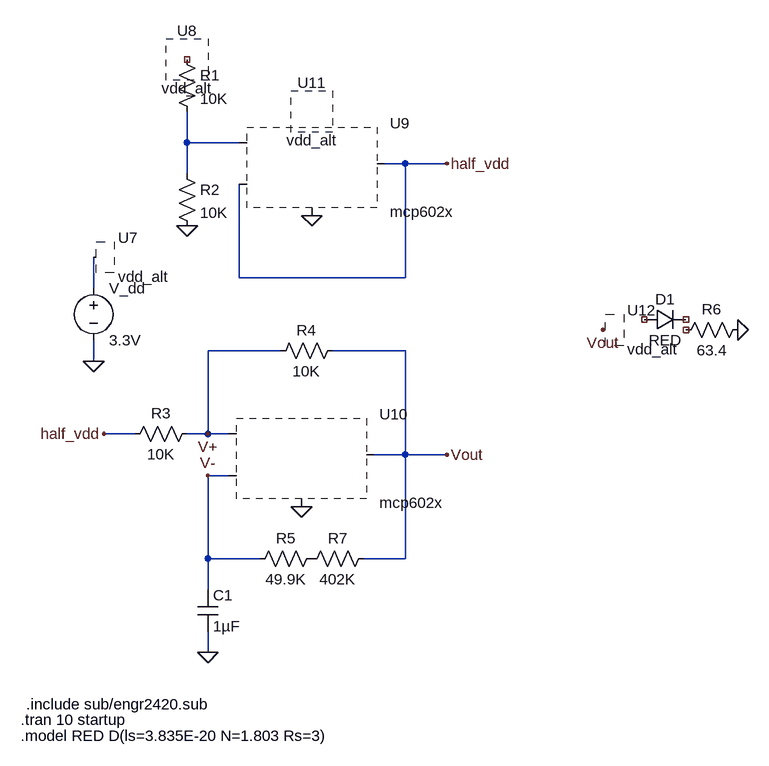
[diagram p0: schematic mp1_sim.asc]
mp1_sim.asc, the LTspice schematic file:
Version 4.1
SHEET 1 1284 680
WIRE 416 -608 416 -656
WIRE 496 -608 416 -608
WIRE 752 -576 720 -576
WIRE 816 -576 752 -576
WIRE 416 -560 416 -608
WIRE 496 -400 496 -544
WIRE 752 -400 752 -576
WIRE 752 -400 496 -400
WIRE 272 -384 272 -432
WIRE 560 -288 448 -288
WIRE 752 -288 640 -288
WIRE 272 -272 272 -304
WIRE 336 -160 288 -160
WIRE 448 -160 448 -288
WIRE 448 -160 416 -160
WIRE 480 -160 448 -160
WIRE 752 -128 752 -288
WIRE 752 -128 704 -128
WIRE 816 -128 752 -128
WIRE 480 -96 448 -96
WIRE 448 32 448 -96
WIRE 528 32 448 32
WIRE 752 32 752 -128
WIRE 752 32 688 32
WIRE 448 80 448 32
WIRE 448 176 448 144
FLAG 272 -272 0
FLAG 608 -496 0
FLAG 592 -48 0
FLAG 416 -480 0
FLAG 816 -576 half_vdd
FLAG 288 -160 half_vdd
FLAG 448 176 0
FLAG 816 -128 Vout
FLAG 1264 -320 0
FLAG 1056 -320 Vout
FLAG 448 -160 V+
FLAG 448 -96 V-
SYMBOL voltage 272 -400 R0
SYMATTR InstName V_dd
SYMATTR Value 3.3V
SYMBOL res 400 -752 R0
SYMATTR InstName R1
SYMATTR Value 10K
SYMATTR SpiceLine tol=1 pwr=1/10
SYMBOL res 400 -576 R0
SYMATTR InstName R2
SYMATTR Value 10K
SYMATTR SpiceLine tol=1 pwr=1/10
SYMBOL res 432 -176 R90
WINDOW 0 0 56 VBottom 2
WINDOW 3 32 56 VTop 2
SYMATTR InstName R3
SYMATTR Value 10K
SYMATTR SpiceLine tol=1 pwr=1/10
SYMBOL res 656 -304 R90
WINDOW 0 0 56 VBottom 2
WINDOW 3 32 56 VTop 2
SYMATTR InstName R4
SYMATTR Value 10K
SYMATTR SpiceLine tol=1 pwr=1/10
SYMBOL cap 432 80 R0
SYMATTR InstName C1
SYMATTR Value 1µF
SYMATTR SpiceLine V=25
SYMBOL diode 1120 -320 R270
WINDOW 0 32 32 VTop 2
WINDOW 3 0 32 VBottom 2
SYMATTR InstName D1
SYMATTR Value RED
SYMBOL res 1280 -336 R90
WINDOW 0 0 56 VBottom 2
WINDOW 3 32 56 VTop 2
SYMATTR InstName R6
SYMATTR Value 63.4
SYMATTR SpiceLine tol=1 pwr=1/10
SYMBOL vdd_alt 272 -432 R0
SYMATTR InstName U7
SYMBOL vdd_alt 416 -736 R0
SYMATTR InstName U8
SYMBOL mcp602x 592 -576 R0
SYMATTR InstName U9
SYMBOL mcp602x 576 -128 R0
SYMATTR InstName U10
SYMBOL vdd_alt 608 -656 R0
SYMATTR InstName U11
SYMBOL vdd_alt 592 -208 R0
SYMATTR InstName U12
SYMBOL res 624 16 R90
WINDOW 0 0 56 VBottom 2
WINDOW 3 32 56 VTop 2
SYMATTR InstName R5
SYMATTR Value 49.9K
SYMATTR SpiceLine tol=1 pwr=1/10
SYMBOL res 704 16 R90
WINDOW 0 0 56 VBottom 2
WINDOW 3 32 56 VTop 2
SYMATTR InstName R7
SYMATTR Value 402K
SYMATTR SpiceLine tol=1 pwr=1/10
TEXT 168 256 Left 2 !.include sub/engr2420.sub
TEXT 160 280 Left 2 !.tran 10 startup
TEXT 160 304 Left 2 !.model RED D(ls=3.835E-20 N=1.803 Rs=3)

The netlist it stands for:
* mp1_sim.asc
V_dd N002 0 3.3V
R1 NC_01 N001 10K tol=1 pwr=1/10
R2 N001 0 10K tol=1 pwr=1/10
R3 V+ half_vdd 10K tol=1 pwr=1/10
R4 Vout V+ 10K tol=1 pwr=1/10
C1 V- 0 1µF V=25
D1 NC_02 NC_03 RED
R6 0 NC_04 63.4 tol=1 pwr=1/10
* U7: vdd_alt (symbol vdd_alt not available, pin order unknown); nets seen at it: N002
* U8: vdd_alt (symbol vdd_alt not available, pin order unknown); nets seen at it: 
* U9: mcp602x (symbol mcp602x not available, pin order unknown); nets seen at it: 0, half_vdd, N001
* U10: mcp602x (symbol mcp602x not available, pin order unknown); nets seen at it: 0, V+, V-, Vout
* U11: vdd_alt (symbol vdd_alt not available, pin order unknown); nets seen at it: 
* U12: vdd_alt (symbol vdd_alt not available, pin order unknown); nets seen at it: Vout
R5 P001 V- 49.9K tol=1 pwr=1/10
R7 Vout P001 402K tol=1 pwr=1/10
.model D D
.lib standard.dio
.include sub/engr2420.sub
.tran 10 startup
.model RED D(ls=3.835E-20 N=1.803 Rs=3)
.backanno
.end